# EAGLE schematic 1M_board (EAGLE 9.2.2)
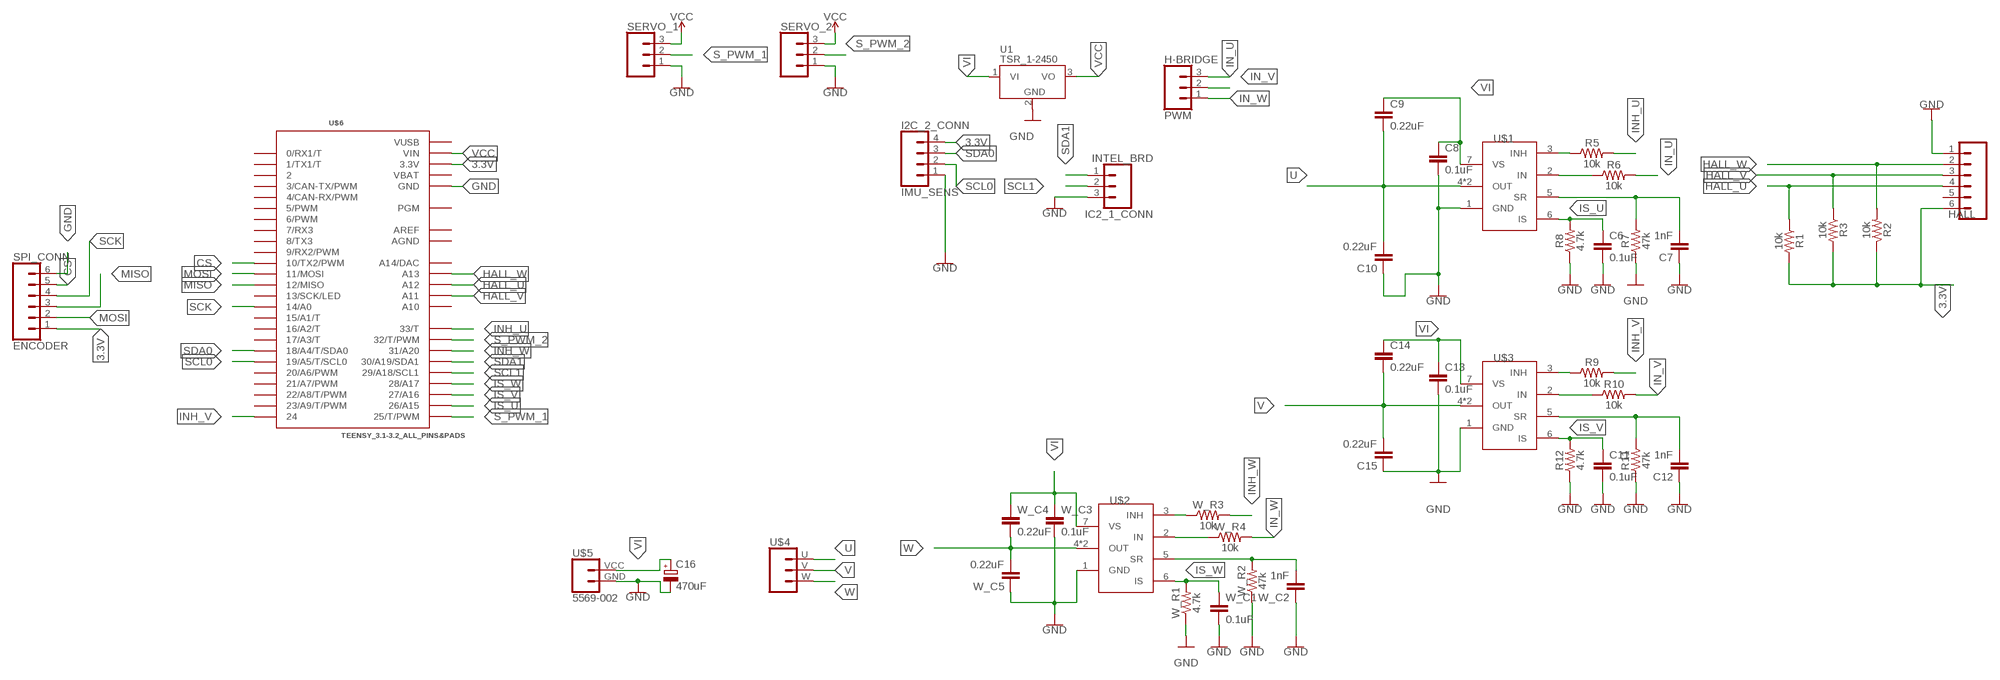
[diagram p0: schematic, sheet 1]

## Parts
C6  0.1uF  0.1UF-0603-25V-5%  [0603]
C7  1nF  1.0NF/1000PF-0603-50V-10%  [0603]
C8  0.1uF  0.1UF-0603-25V-5%  [0603]
C9  0.22uF  0.22UF-0603-25V-10%  [0603]
C10  0.22uF  0.22UF-0603-25V-10%  [0603]
C11  0.1uF  0.1UF-0603-25V-5%  [0603]
C12  1nF  1.0NF/1000PF-0603-50V-10%  [0603]
C13  0.1uF  0.1UF-0603-25V-5%  [0603]
C14  0.22uF  0.22UF-0603-25V-10%  [0603]
C15  0.22uF  0.22UF-0603-25V-10%  [0603]
C16  470uF  CPOL-EUE2,5-6E  [E2,5-6E]
H-BRIDGE  PWM  CONN_031X03_NO_SILK  [1X03_NO_SILK]
HALL  CONN_06SMD-1MM  [1X06-1MM]
I2C_2_CONN  IMU_SENS  CONN_041X04_NO_SILK  [1X04_NO_SILK]
IC2_1_CONN  INTEL_BRD  CONN_031X03_NO_SILK  [1X03_NO_SILK]
R1  10k  10KOHM-0603-1/10W-1%  [0603]
R2  10k  10KOHM-0603-1/10W-1%  [0603]
R3  10k  10KOHM-0603-1/10W-1%  [0603]
R5  10k  10KOHM-0603-1/10W-1%  [0603]
R6  10k  10KOHM-0603-1/10W-1%  [0603]
R7  47k  47KOHM-0603-1/10W-1%  [0603]
R8  4.7k  4.7KOHM-0603-1/10W-1%  [0603]
R9  10k  10KOHM-0603-1/10W-1%  [0603]
R10  10k  10KOHM-0603-1/10W-1%  [0603]
R11  47k  47KOHM-0603-1/10W-1%  [0603]
R12  4.7k  4.7KOHM-0603-1/10W-1%  [0603]
SERVO_1  CONN_031X03_NO_SILK  [1X03_NO_SILK]
SERVO_2  CONN_031X03_NO_SILK  [1X03_NO_SILK]
SPI_CONN  ENCODER  CONN_06SMD-1MM  [1X06-1MM]
U1  TSR_1-2450  [TSR-1]
U$1  IFX007TZZZZ  [P-TO263-7-1]
U$2  IFX007TZZZZ  [P-TO263-7-1]
U$3  IFX007TZZZZ  [P-TO263-7-1]
U$4  5569-003  [5569-003]
U$5  5569-002  [5569-002]
U$6  TEENSY_3.1-3.2_ALL_PINS&PADS  [TEENSY_3.0-3.2_ALL_PINS_&_PADS]
W_C1  0.1uF  0.1UF-0603-25V-5%  [0603]
W_C2  1nF  1.0NF/1000PF-0603-50V-10%  [0603]
W_C3  0.1uF  0.1UF-0603-25V-5%  [0603]
W_C4  0.22uF  0.22UF-0603-25V-10%  [0603]
W_C5  0.22uF  0.22UF-0603-25V-10%  [0603]
W_R1  4.7k  4.7KOHM-0603-1/10W-1%  [0603]
W_R2  47k  47KOHM-0603-1/10W-1%  [0603]
W_R3  10k  10KOHM-0603-1/10W-1%  [0603]
W_R4  10k  10KOHM-0603-1/10W-1%  [0603]

## Nets
3.3V: HALL.6 I2C_2_CONN.4 R1.2 R2.1 R3.2 SPI_CONN.1 U$6.3.3V U$6.3.3V1(3.3V) U$6.3.3V2(3.3V)
CS: SPI_CONN.5 U$6.10(10/TX2/PWM)
GND: C6.2 C7.1 C8.2 C10.1 C11.2 C12.1 C13.2 C15.1 C16.- HALL.1 I2C_2_CONN.1 IC2_1_CONN.3 R7.1 R8.1 R11.1 R12.1 SERVO_1.1 SERVO_2.1 SPI_CONN.6 U1.2(GND) U$1.1(GND) U$2.1(GND) U$3.1(GND) U$5.GND U$6.GND U$6.GND1(GND) U$6.GND2(GND) W_C1.2 W_C2.1 W_C3.2 W_C5.1 W_R1.1 W_R2.1
HALL_U: HALL.4 R1.1 U$6.A12
HALL_V: HALL.3 R3.1 U$6.A11
HALL_W: HALL.2 R2.2 U$6.A13
IN_U: H-BRIDGE.3 R6.2
IN_V: H-BRIDGE.2 R10.2
IN_W: H-BRIDGE.1 W_R4.2
INH_U: R5.2 U$6.33(33/T)
INH_V: R9.2 U$6.24
INH_W: U$6.31(31/A20) W_R3.2
IS_U: C6.1 R8.2 U$1.6(IS) U$6.26(26/A15)
IS_V: C11.1 R12.2 U$3.6(IS) U$6.27(27/A16)
IS_W: U$2.6(IS) U$6.28(28/A17) W_C1.1 W_R1.2
MISO: SPI_CONN.3 U$6.12(12/MISO)
MOSI: SPI_CONN.2 U$6.11(11/MOSI)
N$1: U$2.3(INH) W_R3.1
N$2: C12.2 R11.2 U$3.5(SR)
N$3: U$2.5(SR) W_C2.2 W_R2.2
N$10: C7.2 R7.2 U$1.5(SR)
N$11: R5.1 U$1.3(INH)
N$14: R6.1 U$1.2(IN)
N$18: R9.1 U$3.3(INH)
N$20: U$2.2(IN) W_R4.1
N$24: R10.1 U$3.2(IN)
S_PWM_1: SERVO_1.2 U$6.25(25/T/PWM)
S_PWM_2: SERVO_2.2 U$6.32(32/T/PWM)
SCK: SPI_CONN.4 U$6.14/A0
SCL0: I2C_2_CONN.2 U$6.19/A5(19/A5/T/SCL0)
SCL1: IC2_1_CONN.2 U$6.29(29/A18/SCL1)
SDA0: I2C_2_CONN.3 U$6.18/A4(18/A4/T/SDA0)
SDA1: IC2_1_CONN.1 U$6.30(30/A19/SDA1)
U: C9.2 C10.2 U$1.4(OUT) U$1.8(OUT) U$4.U(W)
V: C14.2 C15.2 U$3.4(OUT) U$3.8(OUT) U$4.V(U)
VCC: SERVO_1.3 SERVO_2.3 U1.3(VO) U$6.VIN
VI: C8.1 C9.1 C13.1 C14.1 C16.+ U1.1(VI) U$1.7(VS) U$2.7(VS) U$3.7(VS) U$5.VCC W_C3.1 W_C4.1
W: U$2.4(OUT) U$2.8(OUT) U$4.W(V) W_C4.2 W_C5.2
Unconnected: HALL.5 U$6.0(0/RX1/T) U$6.1(1/TX1/T) U$6.2 U$6.3(3/CAN-TX/PWM) U$6.4(4/CAN-RX/PWM) U$6.5(5/PWM) U$6.6(6/PWM) U$6.7(7/RX3) U$6.8(8/TX3) U$6.9(9/RX2/PWM) U$6.13(13/SCK/LED) U$6.15/A1(15/A1/T) U$6.16/A2(16/A2/T) U$6.17/A3(17/A3/T) U$6.20/A6(20/A6/PWM) U$6.21/A7(21/A7/PWM) U$6.22/A8(22/A8/T/PWM) U$6.23/A9(23/A9/T/PWM) U$6.A10 U$6.PGM U$6.RESET/DAC(A14/DAC)

## Power pins joined to a net without a drawn wire
AGND: U$6.AGND
AREF: U$6.AREF
VBAT: U$6.VBAT
VUSB: U$6.VUSB

## Library data of the parts
C6 C8 C11 C13 W_C1 W_C3 = SparkFun-Capacitors:0.1UF: 0.1µF ceramic capacitors A capacitor is a passive two-terminal electrical component used to store electrical energy temporarily in an electric field.; PROD_ID: CAP-08604
C7 C12 W_C2 = SparkFun-Capacitors:1.0NF/1000PF: 1nF/1,000pF ceramic capacitors A capacitor is a passive two-terminal electrical component used to store electrical energy temporarily in an electric field.; PROD_ID: CAP-07886
C9 C10 C14 C15 W_C4 W_C5 = SparkFun-Capacitors:0.22UF: 0.22µF ceramic capacitors A capacitor is a passive two-terminal electrical component used to store electrical energy temporarily in an electric field.; PROD_ID: CAP-07822
C16 = rcl:CPOL-EU: POLARIZED CAPACITOR, European symbol; SPICEPREFIX: C
H-BRIDGE IC2_1_CONN SERVO_1 SERVO_2 = SparkFun-Connectors:CONN_03: Multi connection point. Often used as Generic Header-pin footprint for 0.1 inch spaced/style header connections On any of the 0.1 inch spaced packages, you can populate with these: Break Away Headers - Straight <https://www.sparkfun.com/products/116> (PRT-00116) Break Away Male Headers - Right Angle <https://www.sparkfun.com/products/553> (PRT-00553) Female Headers <https://www.sparkfun.com/products/115> (PRT-00115) Break Away Headers - Machine Pin <https://www.sparkfun.com/products/117> (PRT-00117) Break Away Female Headers - Swiss Machine Pin <https://www.sparkfun.com/products/743> (PRT-00743) Stackable Header - 3 Pin (Female, 0.1") <https://www.sparkfun.com/products/13875> (PRT-13875) For SCREWTERMINALS and SPRING TERMINALS visit here: Screw Terimnals on SparkFun.com <https://www.sparkfun.com/search/results?term=Screw+Terminals> (5mm/3.5mm/2.54mm spacing) This device is also useful as a general connection point to wire up your design to another part of your project. Our various solder wires solder well into these plated through hole pads. Hook-Up Wire - Assortment (Stranded, 22 AWG) <https://www.sparkfun.com/products/11375> (PRT-11375) Hook-Up Wire - Assortment (Solid Core, 22 AWG) <https://www.sparkfun.com/products/11367> (PRT-11367) View the entire wire category on our website here <https://www.sparkfun.com/categories/141> Special notes: Molex polarized connector foot print use with SKU : PRT-08232 with associated crimp pins and housings.
HALL SPI_CONN = SparkFun-Connectors:CONN_06: Multi connection point. Often used as Generic Header-pin footprint for 0.1 inch spaced/style header connections On any of the 0.1 inch spaced packages, you can populate with these: Break Away Headers - Straight <https://www.sparkfun.com/products/116> (PRT-00116) Break Away Male Headers - Right Angle <https://www.sparkfun.com/products/553> (PRT-00553) Female Headers <https://www.sparkfun.com/products/115> (PRT-00115) Break Away Headers - Machine Pin <https://www.sparkfun.com/products/117> (PRT-00117) Break Away Female Headers - Swiss Machine Pin <https://www.sparkfun.com/products/743> (PRT-00743) Arduino Stackable Header - 6 Pin <https://www.sparkfun.com/products/9280> (PRT-09280) For SCREWTERMINALS and SPRING TERMINALS visit here: Screw Terimnals on SparkFun.com <https://www.sparkfun.com/search/results?term=Screw+Terminals> (5mm/3.5mm/2.54mm spacing) This device is also useful as a general connection point to wire up your design to another part of your project. Our various solder wires solder well into these plated through hole pads. Hook-Up Wire - Assortment (Stranded, 22 AWG) <https://www.sparkfun.com/products/11375> (PRT-11375) Hook-Up Wire - Assortment (Solid Core, 22 AWG) <https://www.sparkfun.com/products/11367> (PRT-11367) View the entire wire category on our website here <https://www.sparkfun.com/categories/141>; PROD_ID: CONN-08249; SF_ID: GPS-00579
I2C_2_CONN = SparkFun-Connectors:CONN_04: Multi connection point. Often used as Generic Header-pin footprint for 0.1 inch spaced/style header connections On any of the 0.1 inch spaced packages, you can populate with these: Break Away Headers - Straight <https://www.sparkfun.com/products/116> (PRT-00116) Break Away Male Headers - Right Angle <https://www.sparkfun.com/products/553> (PRT-00553) Female Headers <https://www.sparkfun.com/products/115> (PRT-00115) Break Away Headers - Machine Pin <https://www.sparkfun.com/products/117> (PRT-00117) Break Away Female Headers - Swiss Machine Pin <https://www.sparkfun.com/products/743> (PRT-00743) For SCREWTERMINALS and SPRING TERMINALS visit here: Screw Terimnals on SparkFun.com <https://www.sparkfun.com/search/results?term=Screw+Terminals> (5mm/3.5mm/2.54mm spacing) This device is also useful as a general connection point to wire up your design to another part of your project. Our various solder wires solder well into these plated through hole pads. Hook-Up Wire - Assortment (Stranded, 22 AWG) <https://www.sparkfun.com/products/11375> (PRT-11375) Hook-Up Wire - Assortment (Solid Core, 22 AWG) <https://www.sparkfun.com/products/11367> (PRT-11367) View the entire wire category on our website here <https://www.sparkfun.com/categories/141> Special notes: Molex polarized connector foot print use with SKU : PRT-08231 with associated crimp pins and housings. 1MM SMD Version SKU: PRT-10208; PROD_ID: CONN-09696
R1-R3 R5 R6 R9 R10 W_R3 W_R4 = SparkFun-Resistors:10KOHM: 10kΩ resistor A resistor is a passive two-terminal electrical component that implements electrical resistance as a circuit element. Resistors act to reduce current flow, and, at the same time, act to lower voltage levels within circuits. - Wikipedia; PROD_ID: RES-00824
R7 R11 W_R2 = SparkFun-Resistors:47KOHM: 47kΩ resistor A resistor is a passive two-terminal electrical component that implements electrical resistance as a circuit element. Resistors act to reduce current flow, and, at the same time, act to lower voltage levels within circuits. - Wikipedia; PROD_ID: RES-07871
R8 R12 W_R1 = SparkFun-Resistors:4.7KOHM: 4.7kΩ resistor A resistor is a passive two-terminal electrical component that implements electrical resistance as a circuit element. Resistors act to reduce current flow, and, at the same time, act to lower voltage levels within circuits. - Wikipedia; PROD_ID: RES-07857
U1 = _traco_tsr-1:TSR_1-*: TRACO TSR-1 Series Point-of-Load DC/DC-Converters Vi max. 36 V; Vo = (1.2 .. 15)V ±2%; Io = 0 .. 1 A SIP-Package (drop-in replacement for 78xx linear voltage regulators in TO220-package, vertically assembled) Source: www.tracopower.com Technologies: TSR 1- Vi (V) Vo (V) ±2% Io = 0 .. 1 A 24_ ( generic ) 2412 4.6 .. 36 1.2 2415 4.6 .. 36 1.5 2418 4.6 .. 36 1.8 2425 4.6 .. 36 2.5 2433 4.75.. 36 3.3 2450 6.5 .. 36 5.0 2465 9.0 .. 36 6.5 2490 12 .. 36 9.0 24120 15 .. 36 12 24150 18 .. 36 15 Author: Dipl.-Ing. FH Rainer Bayer HHN Hochschule Heilbronn, rainer.bayer@hs-heilbronn.de Ingenieurbüro ing-rb, mail@ing-rb.de
U$1-U$3 = ITX007T:IFX007T
U$4 = 5569-03:5569-003
U$5 = 5569-02:5569-002
U$6 = Teensy_3_and_LC_Series_Boards_v1.4:TEENSY_3.1-3.2_ALL_PINS&PADS: Footprint for Teensy 3.1 or 3.2 board using all pads and all through-holes. Pads need a 2x7 0.1" SMD header.